# EAGLE design Encoder iC-PX v1b (EAGLE 9.4.2)
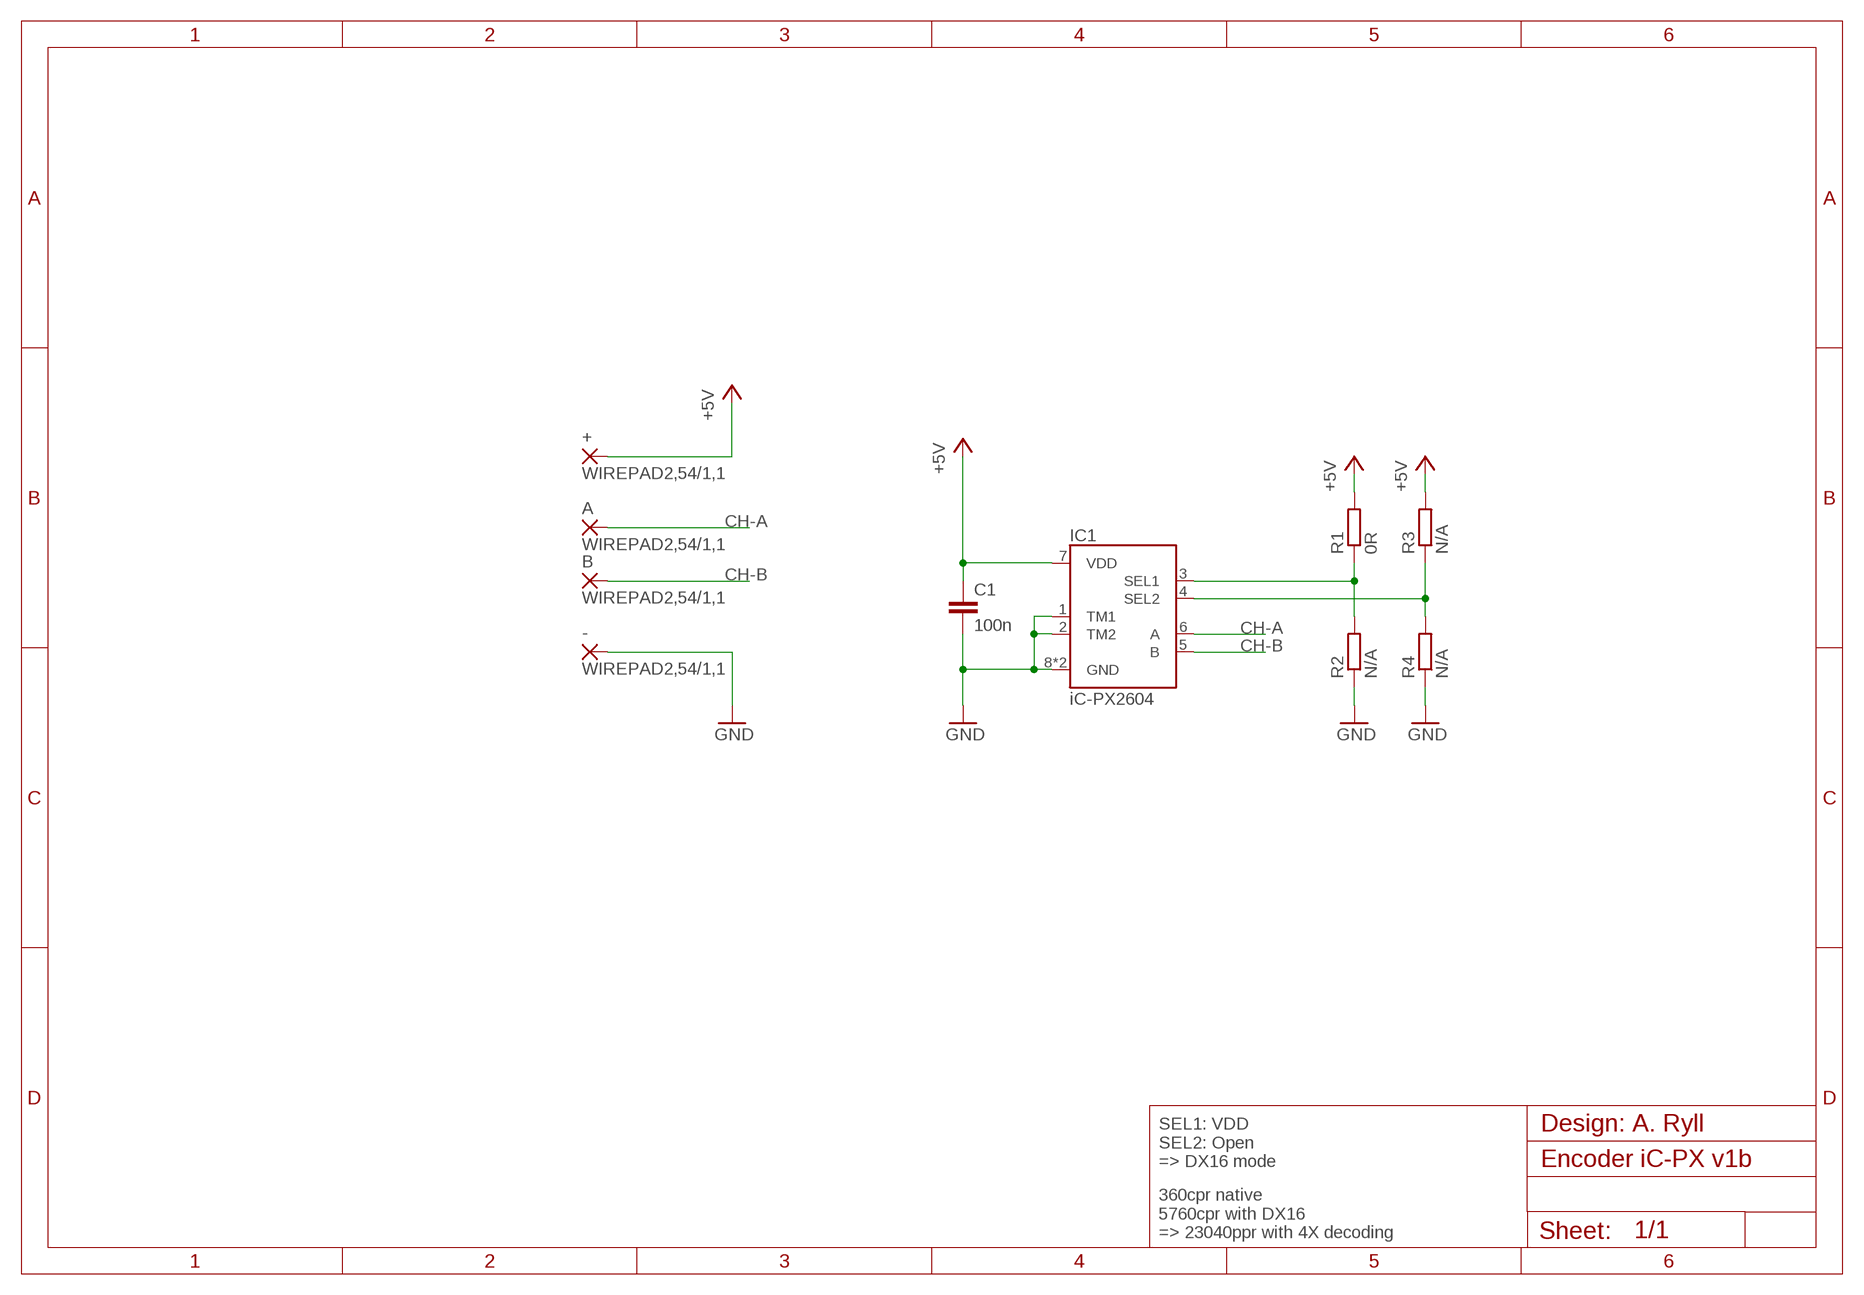
[diagram p0: schematic, sheet 1]

## Parts
+  WIREPAD2,54/1,1  [2,54/1,1]
-  WIREPAD2,54/1,1  [2,54/1,1]
A  WIREPAD2,54/1,1  [2,54/1,1]
B  WIREPAD2,54/1,1  [2,54/1,1]
C1  100n  C-EUC0603  [C0603]
IC1  iC-PX2604  IC-PX  [ODFN8-3X3]
R1  0R  R-EU_R0603  [R0603]
R2  N/A  R-EU_R0603  [R0603]
R3  N/A  R-EU_R0603  [R0603]
R4  N/A  R-EU_R0603  [R0603]

## Nets
+5V: +.1(P) C1.1 IC1.7(VDD) R1.2 R3.2
CH-A: A.1(P) IC1.6(A)
CH-B: B.1(P) IC1.5(B)
GND: -.1(P) C1.2 IC1.1(TM1) IC1.2(TM2) IC1.8(GND) IC1.BP(GND) R2.1 R4.1
SEL1: IC1.3(SEL1) R1.1 R2.2
SEL2: IC1.4(SEL2) R3.1 R4.2

## Notes on the sheet
- Design: A. Ryll
- SEL1: VDD
  SEL2: Open
  => DX16 mode
- 360cpr native
  5760cpr with DX16
  => 23040ppr with 4X decoding

## Library data of the parts
+ - A B = wirepad:WIREPAD: Wire PAD connect wire on PCB
C1 = rcl:C-EU: CAPACITOR, European symbol; SPICEPREFIX: C
IC1 = TIGERs:IC-PX
R1-R4 = rcl:R-EU_: RESISTOR, European symbol; SPICEPREFIX: R

## Board
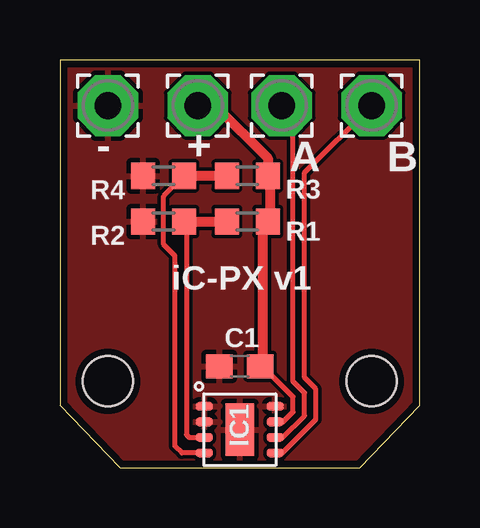
[diagram p1: board, top side]
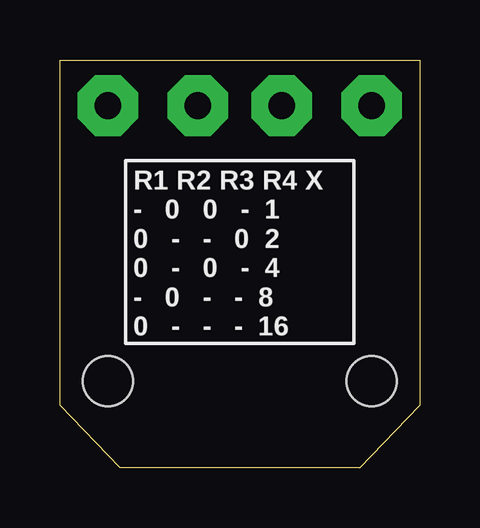
[diagram p2: board, bottom side, seen from below]

Size 15 x 17 mm. Coordinates in mm from the lower left corner, seen from the top.
Outline: 2.5,0 12.5,0 15,2.6 15,17 0,17 0,2.6 2.5,0
Copper layers (1*16): Top 0.035mm / dielectric 1.5mm / Bottom 0.035mm
Design rules "PCB-POOL Standard": minimum track width 0.15mm, minimum drill 0.3mm, track to track 0.15mm, track to pad 0.15mm, pad to pad 0.15mm, via to via 0.15mm, smd to smd 0.15mm, copper to edge 0.3mm, drill to drill 0.2mm, minimum pad ring 0.2mm, minimum via ring 0.15mm, stop-mask expansion 0.075mm, vias tented up to drill 0mil, thermal gap 0.2mm
Holes 2.1 mm at 2,3.6 13,3.6
tKeepout: area 0,1.6 to 4,5.6; area 11,1.6 to 15,5.6; area -9,-24.9 to 24,8.1

### Footprints (pad centres in the part's own frame; a part is rotated, then mirrored left to right if it is on the bottom)
2,54/1,1 = drill 1.118 pad 2.54 octagon: 1 0,0
C0603 = smd 1.1 x 1: 1 -0.85,0; 2 0.85,0
ODFN8-3X3 = smd 0.7 x 0.35: 1 -1.475,0.975; 2 -1.475,0.325; 3 -1.475,-0.325; 4 -1.475,-0.975; 5 1.475,-0.975; 6 1.475,-0.325; 7 1.475,0.325; 8 1.475,0.975 | smd 1.2 x 2.2: BP 0,0
R0603 = smd 1 x 1.1: 1 -0.85,0; 2 0.85,0

### Placement (x,y rotation side)
+  5.75,15.1 0 top
-  2,15.1 0 top
A  9.25,15.1 0 top
B  13,15.1 0 top
C1  7.5,4.23 180 top
IC1  7.5,1.58 0 top
R1  7.82,10.26 0 top
R2  4.33,10.26 0 top
R3  7.82,12.16 0 top
R4  4.33,12.16 0 top

### Tracks (layer width: path | path; a pad name or v marks a point on that pad's centre or on a via)
+5V
  Top 0.203: IC1.7 9.31,1.91 9.72,2.32 9.72,2.96 8.45,4.23 C1.1
  Top 0.406: C1.1 8.45,4.33 8.45,10.04 R1.2 8.77,10.36 8.77,12.06 R3.2 8.67,12.9 6.47,15.1 +.1
CH-A
  Top 0.203: A.1 9.72,14.63 9.72,3.59 10.2,3.12 10.2,2.16 9.29,1.26 IC1.6
CH-B
  Top 0.203: B.1 10.2,12.3 10.2,3.75 10.68,3.27 10.68,2 9.28,0.61 IC1.5
GND
  pour Top: -0.44,17.88 15.76,17.88 15.76,-0.54 -0.44,-0.54
SEL1
  Top 0.203: IC1.3 5.39,1.26 5.28,1.37 5.28,10.16 R2.2
  Top 0.406: R2.2 R1.1
SEL2
  Top 0.203: R4.2 4.33,11.31 4.33,9.31 4.8,8.83 4.8,0.89 5.09,0.61 IC1.4
  Top 0.406: R3.1 R4.2

### Text on the board
tPlace: iC-PX v1
bPlace: R1 R2 R3 R4 X / - 0 0 - 1 / 0 - - 0 2 / 0 - 0 - 4 / - 0 - - 8 / 0 - - - 16